# EAGLE schematic big_seven_v0.2 (EAGLE 6.5.0)
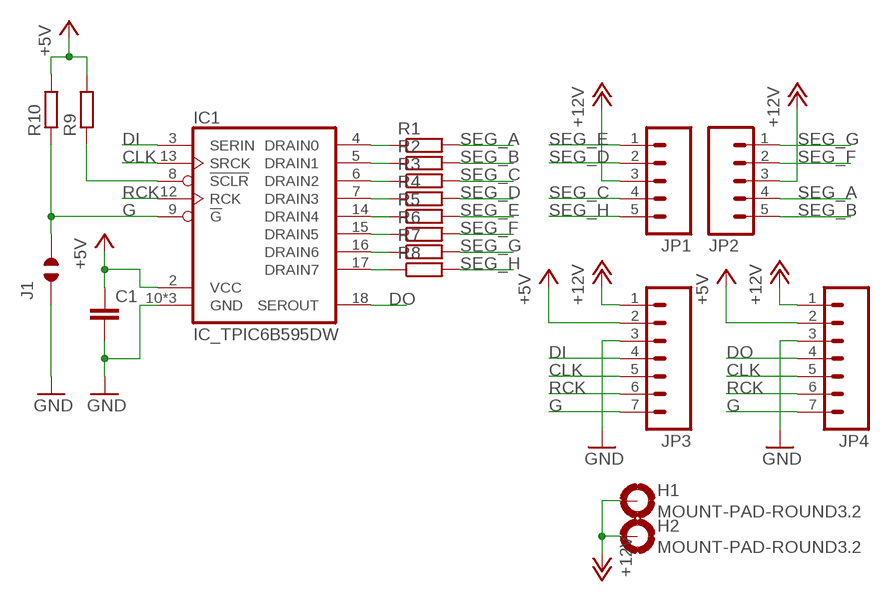
[diagram p0: schematic, sheet 1]

## Parts
C1  C-EUC0805  [C0805]
H1  MOUNT-PAD-ROUND3.2  [3,2-PAD]
H2  MOUNT-PAD-ROUND3.2  [3,2-PAD]
IC1  IC_TPIC6B595DW  [SOIC-20]
J1  JUMPER_SOLDER_1X2  [JUMPER_SOLDER_1X2]
JP1  M05PTH  [1X05]
JP2  M05PTH  [1X05]
JP3  M07LONGPADS  [1X07_LONGPADS]
JP4  M07LONGPADS  [1X07_LONGPADS]
R1  R-EU_M1206  [M1206]
R2  R-EU_M1206  [M1206]
R3  R-EU_M1206  [M1206]
R4  R-EU_M1206  [M1206]
R5  R-EU_M1206  [M1206]
R6  R-EU_M1206  [M1206]
R7  R-EU_M1206  [M1206]
R8  R-EU_M1206  [M1206]
R9  R-EU_M0805  [M0805]
R10  R-EU_M0805  [M0805]

## Nets
+5V: C1.1 IC1.2(VCC) JP3.2 JP4.2 R9.2 R10.2
+12V: H1.B3,2(MOUNT) H2.B3,2(MOUNT) JP1.3 JP2.3 JP3.1 JP4.1
CLK: IC1.13(SRCK) JP3.5 JP4.5
DI: IC1.3(SERIN) JP3.4
DO: IC1.18(SEROUT) JP4.4
G: IC1.9(!G) J1.2 JP3.7 JP4.7 R10.1
GND: C1.2 IC1.10(GND) IC1.11(GND) IC1.19(GND) J1.1 JP3.3 JP4.3
N$1: IC1.4(DRAIN0) R1.1
N$2: IC1.5(DRAIN1) R2.1
N$4: IC1.6(DRAIN2) R3.1
N$5: IC1.7(DRAIN3) R4.1
N$6: IC1.14(DRAIN4) R5.1
N$8: IC1.15(DRAIN5) R6.1
N$9: IC1.16(DRAIN6) R7.1
N$11: IC1.17(DRAIN7) R8.1
N$13: IC1.8(!SCLR) R9.1
RCK: IC1.12(RCK) JP3.6 JP4.6
SEG_A: JP2.4 R1.2
SEG_B: JP2.5 R2.2
SEG_C: JP1.4 R3.2
SEG_D: JP1.2 R4.2
SEG_E: JP1.1 R5.2
SEG_F: JP2.2 R6.2
SEG_G: JP2.1 R7.2
SEG_H: JP1.5 R8.2

## Library data of the parts
C1 = rcl:C-EU: CAPACITOR, European symbol
H1 H2 = holes:MOUNT-PAD-ROUND: MOUNTING PAD, round
IC1 = dp_devices:IC_TPIC6B595
J1 = dp_devices:JUMPER_SOLDER_1X2
JP1 JP2 = SparkFun-Connectors:M05: Header 5 Standard 5-pin 0.1" header. Use with straight break away headers (SKU : PRT-00116), right angle break away headers (PRT-00553), swiss pins (PRT-00743), machine pins (PRT-00117), and female headers (PRT-00115). Molex polarized connector foot print use with SKU : PRT-08230 with associated crimp pins and housings.
JP3 JP4 = SparkFun-Connectors:M07: Header 7 Standard 7-pin 0.1" header. Use with straight break away headers (SKU : PRT-00116), right angle break away headers (PRT-00553), swiss pins (PRT-00743), machine pins (PRT-00117), and female headers (PRT-00115). NOTES ON THE VARIANTS LOCK and LOCK_LONGPADS... This footprint was designed to help hold the alignment of a through-hole component (i.e. 7-pin header) while soldering it into place. You may notice that each hole has been shifted either up or down by 0.005 of an inch from it's more standard position (which is usually a perfectly straight line). This slight alteration caused the pins (the squares in the middle) to touch the edges of the holes. Because they are alternating, it causes a "brace" to hold the header in place. 0.005 has proven to be the perfect amount of "off-center" position when using our standard breakaway headers. Although looks a little odd when you look at the bare footprint, once you have a header in there, the alteration is very hard to notice. Also, if you push a header all the way into place, it is covered up entirely on the bottom side. This idea of altering the position of holes to aid alignment will be further integrated into the Sparkfun Library for other footprints. It can help hold any component with 3 or more connection pins.
R1-R10 = rcl:R-EU_: RESISTOR, European symbol